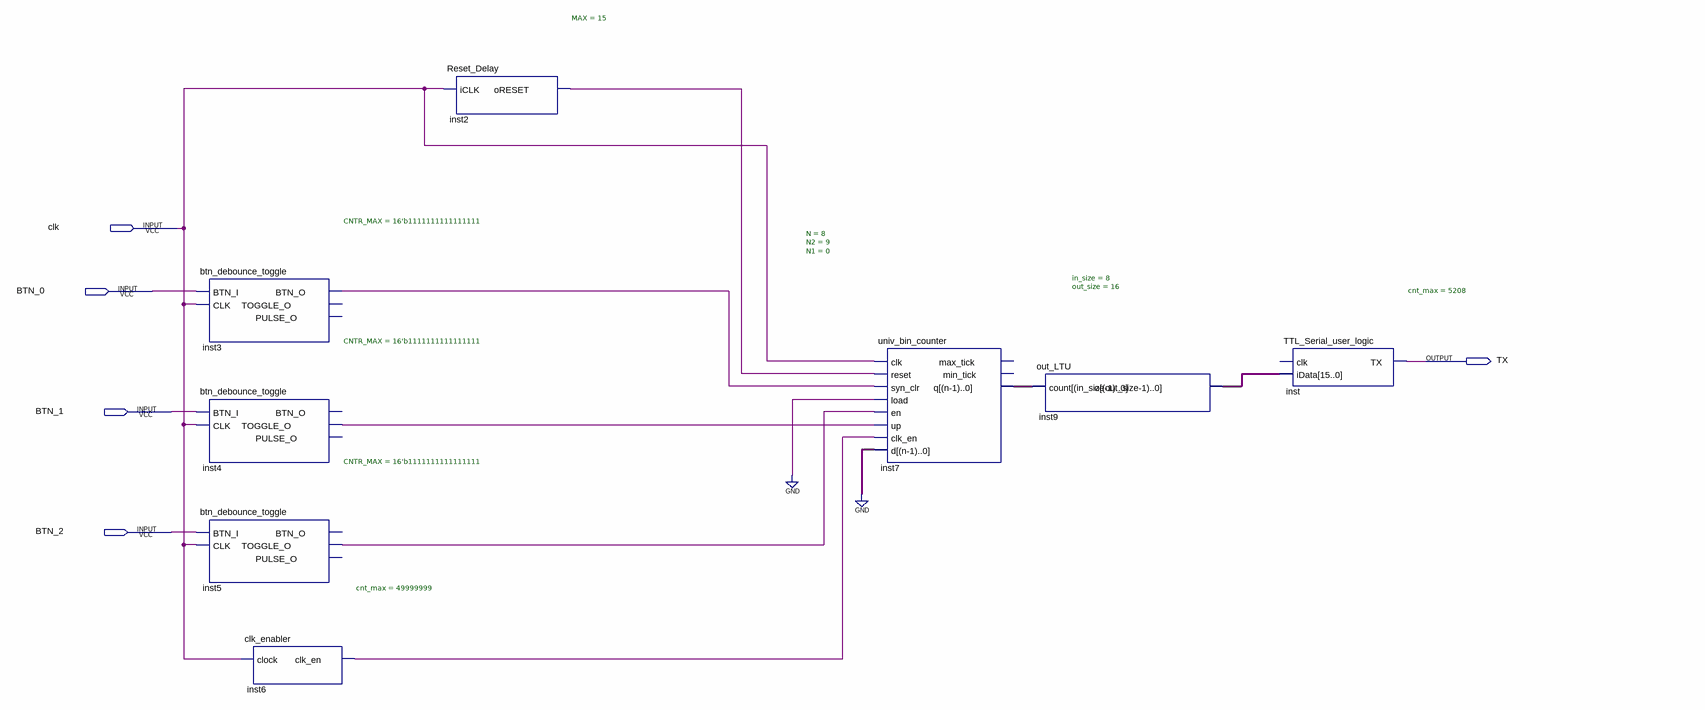
[diagram p0: schematic sheet]
// Quartus schematic Lab_5_7_segment_display.bdf as structural Verilog: 8 symbols, 5 pins
module Lab_5_7_segment_display (
  input  clk,
  input  BTN_0,
  input  BTN_1,
  input  BTN_2,
  output TX
);

  wire inst2_oreset, inst3_btn_o, inst4_toggle_o, inst5_toggle_o, inst6_clk_en;
  wire [7:0] inst7_q;
  wire [15:0] inst9_o;

  btn_debounce_toggle #(.CNTR_MAX(16'b1111111111111111)) inst3 (
    .BTN_I(BTN_0), .CLK(clk), .BTN_O(inst3_btn_o));  // open: TOGGLE_O, PULSE_O
  btn_debounce_toggle #(.CNTR_MAX(16'b1111111111111111)) inst4 (
    .BTN_I(BTN_1), .CLK(clk), .TOGGLE_O(inst4_toggle_o));  // open: BTN_O, PULSE_O
  btn_debounce_toggle #(.CNTR_MAX(16'b1111111111111111)) inst5 (
    .BTN_I(BTN_2), .CLK(clk), .TOGGLE_O(inst5_toggle_o));  // open: BTN_O, PULSE_O
  clk_enabler #(.cnt_max(49999999)) inst6 (.clock(clk), .clk_en(inst6_clk_en));
  Reset_Delay #(.MAX(15)) inst2 (.iCLK(clk), .oRESET(inst2_oreset));
  univ_bin_counter #(.N(8), .N2(9), .N1(0)) inst7 (
    .clk(clk), .reset(inst2_oreset), .syn_clr(inst3_btn_o), .load(1'b0), .en(inst5_toggle_o),
    .up(inst4_toggle_o), .clk_en(inst6_clk_en), .d({8{1'b0}}), .q(inst7_q));  // open: max_tick, min_tick
  out_LTU #(.in_size(8), .out_size(16)) inst9 (.count(inst7_q), .o(inst9_o));
  TTL_Serial_user_logic #(.cnt_max(5208)) inst (.iData(inst9_o), .TX(TX));  // open: clk
endmodule
